# Altium schematic sheet Sheet1.SchDoc
size A
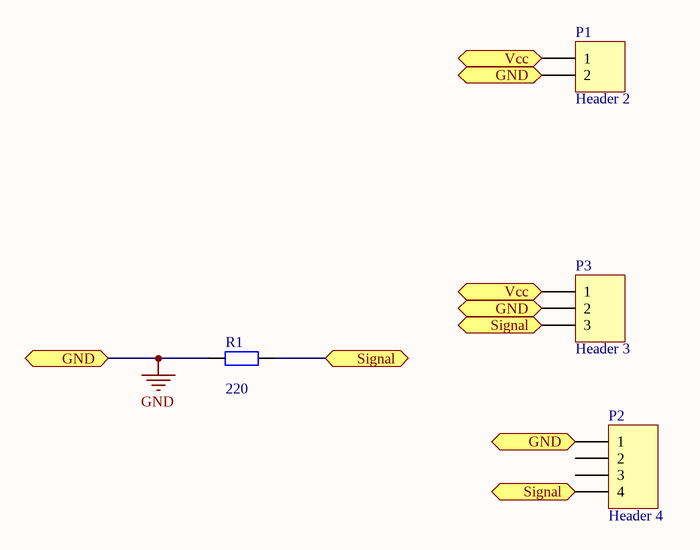
[diagram p0: Sheet1.SchDoc]

## Parts
P1  Header 2  [HDR1X2]
P2  Header 4  [HDR1X4]
P3  Header 3  [HDR1X3]
R1  value 220  [AXIAL-0.4]

## Ports
GND, GND (in), GND (out), Signal, Signal (in), Signal (out), Vcc (in), Vcc (out)

## Nets
GND: P1.2 P2.1 P3.2 R1.2 ; port GND
Signal: P2.4 P3.3 R1.1 ; port Signal
Vcc: P1.1 P3.1 ; port Vcc

Not connected (* = marked no-connect by the designer): P2 2 3

## Library data of the parts
P1 = Header 2: Header, 2-Pin; LatestRevisionDate: 17-Jul-2002; LatestRevisionNote: Re-released for DXP Platform.; Publisher: Altium Limited
P2 = Header 4: Header, 4-Pin; LatestRevisionDate: 17-Jul-2002; LatestRevisionNote: Re-released for DXP Platform.; Publisher: Altium Limited
P3 = Header 3: Header, 3-Pin; LatestRevisionDate: 17-Jul-2002; LatestRevisionNote: Re-released for DXP Platform.; Publisher: Altium Limited
R1 = Res2: Resistor; Published: 8-Jun-2000; LatestRevisionDate: 17-Jul-2002; LatestRevisionNote: Re-released for DXP Platform.; PackageReference: AXIAL-0.4; Publisher: Altium Limited; PackageDescription: Axial Device, Thru-Hole; 2 Leads; 0.4 in Pin Spacing